# Altium schematic sheet Connectors.SchDoc: Connectors
size A4; ApprovedBy: Diogo Gomes; CheckedBy: Bruno, Candido, Pedro; Author: João Vieira; CompanyName: LART; DrawnBy: João Vieira; Organization: LART; Address1: Morro do Lena; Address2: Alto Do Vieiro; Address3: APT 4163, Building D; Revision: v1.4.2; SheetNumber: 3; SheetTotal: 7; ProjectTitle: Autonomous Control Unit; CheckedBy1: G. Candido; CheckedBy2: F. Chen; CheckedBy3: P. Ferreira; CheckedBy4: B. Vicente; CheckedBy5: _; CheckedBy6: _; CheckedBy7: _; version_tag: v1.4.2; Summary: Generic connections IO hardware; ImagePath: C:\Users\micron\Desktop
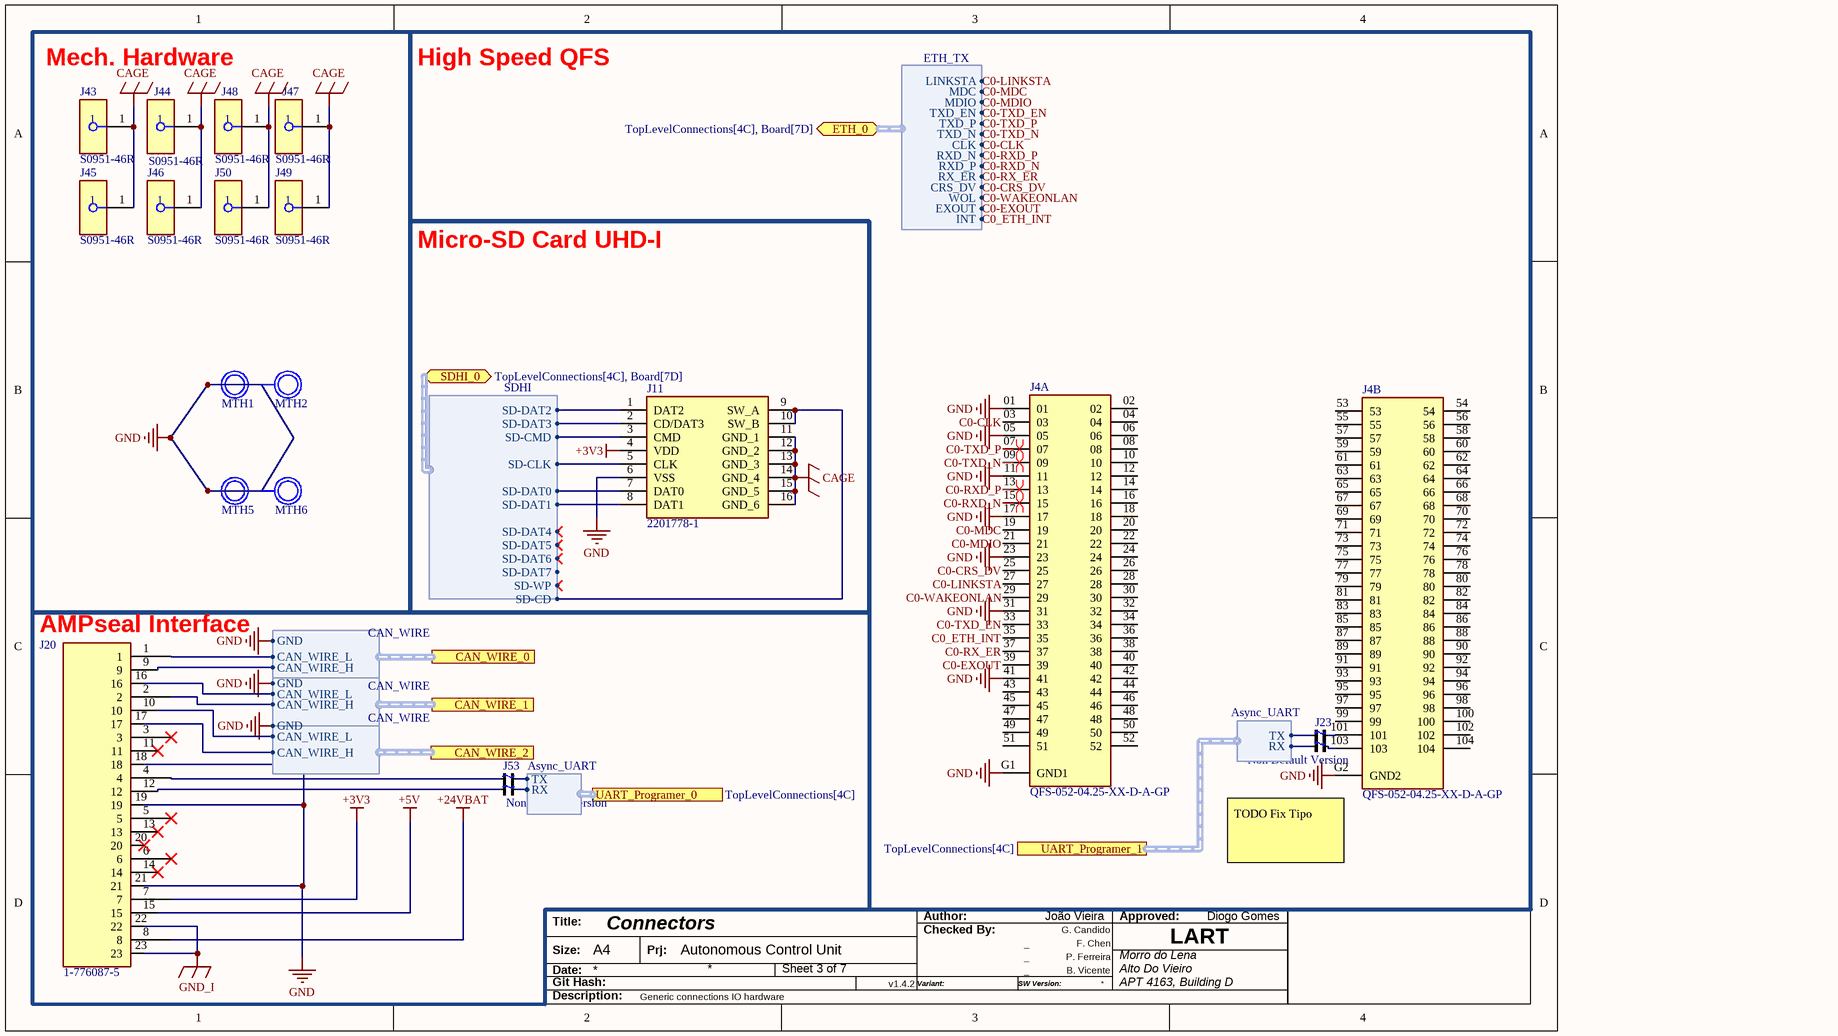
[diagram p0: Connectors.SchDoc]

## Parts
J4  QFS-052-04.25-XX-D-A-GP  [SAMTEC_QFS-052-04.25-XX-D-A-GP]  (parts A,B of 2)
J11  2201778-1  [22017781]
J20  1-776087-5  [TE_1-776087-5]
J23  Non Default Version  [PokaYoke Blank]  (no BOM)
J43  S0951-46R  [FP-S0951-46R-MFG]
J44  S0951-46R  [FP-S0951-46R-MFG]
J45  S0951-46R  [FP-S0951-46R-MFG]
J46  S0951-46R  [FP-S0951-46R-MFG]
J47  S0951-46R  [FP-S0951-46R-MFG]
J48  S0951-46R  [FP-S0951-46R-MFG]
J49  S0951-46R  [FP-S0951-46R-MFG]
J50  S0951-46R  [FP-S0951-46R-MFG]
J53  Non Default Version  [PokaYoke Blank]  (no BOM)
MTH1  Mounting_Hole_3.5mm  [Mounting_Hole_3.5mm]  (value not drawn)
MTH2  Mounting_Hole_3.5mm  [Mounting_Hole_3.5mm]  (value not drawn)
MTH5  Mounting_Hole_3.5mm  [Mounting_Hole_3.5mm]  (value not drawn)
MTH6  Mounting_Hole_3.5mm  [Mounting_Hole_3.5mm]  (value not drawn)

## Blocks framed on the sheet
Mech. Hardware: J43-J50 MTH1 MTH2 MTH5 MTH6
High Speed QFS: J4 J23
Micro-SD Card UHD-I: J11

## Ports
CAN_WIRE_0 (harness CAN_WIRE, see TopLevelConnections[4B], CanFD[3A]), CAN_WIRE_1 (harness CAN_WIRE, see TopLevelConnections[4B], CanFD[3B]), CAN_WIRE_2 (harness CAN_WIRE, see TopLevelConnections[4B], CanFD[3B]), ETH_0 (bidir, harness ETH_TX, see TopLevelConnections[4C], Board[7D]), SDHI_0 (bidir, harness SDHI, see TopLevelConnections[4C], Board[7D]), UART_Programer_0 (harness Async_UART, see TopLevelConnections[4C]), UART_Programer_1 (harness Async_UART, see TopLevelConnections[4C])

## Harnesses
ETH_TX: MDC, MDIO, TXD_EN, TXD_P, TXD_N, CLK, RXD_N, RXD_P, RX_ER, LINKSTA, CRS_DV, WOL, EXOUT, INT
SDHI: SD-CD, SD-CLK, SD-CMD, SD-DAT0, SD-DAT1, SD-DAT2, SD-DAT3, SD-DAT5, SD-DAT6, SD-WP, SD-DAT4, SD-DAT7
CAN_WIRE: GND, CAN_WIRE_H, CAN_WIRE_L
Async_UART: RX, TX

## Nets
+3V3: J11.4(VDD) J20.7
+5V: J20.15
+24VBAT: J20.8
CAGE: J11.11(GND_1) J11.12(GND_2) J11.13(GND_3) J11.14(GND_4) J11.15(GND_5) J11.16(GND_6) J43.1 J44.1 J45.1 J46.1 J47.1 J48.1 J49.1 J50.1
GND: J4.01 J4.05 J4.11 J4.17 J4.23 J4.31 J4.41 J4.G1(GND1) J4.G2(GND2) J11.6(VSS) J20.18 J20.19 J20.21 MTH1.1 MTH2.1 MTH5.1 MTH6.1 ; port CAN_WIRE_1.GND, port CAN_WIRE_0.GND, port CAN_WIRE_2.GND
GND_I: J20.22 J20.23
C0-CLK: J4.03 ; port ETH_0.CLK
C0-CRS_DV: J4.25 ; port ETH_0.CRS_DV
C0-EXOUT: J4.39 ; port ETH_0.EXOUT
C0-LINKSTA: J4.27 ; port ETH_0.LINKSTA
C0-MDC: J4.19 ; port ETH_0.MDC
C0-MDIO: J4.21 ; port ETH_0.MDIO
C0-RX_ER: J4.37 ; port ETH_0.RX_ER
C0-RXD_N: J4.15 ; port ETH_0.RXD_P
C0-RXD_P: J4.13 ; port ETH_0.RXD_N
C0-TXD_EN: J4.33 ; port ETH_0.TXD_EN
C0-TXD_N: J4.09 ; port ETH_0.TXD_N
C0-TXD_P: J4.07 ; port ETH_0.TXD_P
C0-WAKEONLAN: J4.29 ; port ETH_0.WOL
C0_ETH_INT: J4.35 ; port ETH_0.INT
NetJ4_101: J4.101 J23.TX_1
NetJ4_103: J4.103 J23.RX_1
NetJ11_1: J11.1(DAT2) ; port SDHI_0.SD-DAT2
NetJ11_2: J11.2(CD/DAT3) ; port SDHI_0.SD-DAT3
NetJ11_3: J11.3(CMD) ; port SDHI_0.SD-CMD
NetJ11_5: J11.5(CLK) ; port SDHI_0.SD-CLK
NetJ11_7: J11.7(DAT0) ; port SDHI_0.SD-DAT0
NetJ11_8: J11.8(DAT1) ; port SDHI_0.SD-DAT1
NetJ11_9: J11.9(SW_A) J11.10(SW_B) ; port SDHI_0.SD-CD
NetJ20_1: J20.1 ; port CAN_WIRE_0.CAN_WIRE_L
NetJ20_2: J20.2 ; port CAN_WIRE_1.CAN_WIRE_H
NetJ20_4: J20.4 J53.TX_0
NetJ20_9: J20.9 ; port CAN_WIRE_0.CAN_WIRE_H
NetJ20_10: J20.10 ; port CAN_WIRE_2.CAN_WIRE_L
NetJ20_12: J20.12 J53.RX_0
NetJ20_16: J20.16 ; port CAN_WIRE_1.CAN_WIRE_L
NetJ20_17: J20.17 ; port CAN_WIRE_2.CAN_WIRE_H
NetJ23_RX_0: J23.RX_0 ; port UART_Programer_1.RX
NetJ23_TX_0: J23.TX_0 ; port UART_Programer_1.TX
NetJ53_RX_1: J53.RX_1 ; port UART_Programer_0.RX
NetJ53_TX_1: J53.TX_1 ; port UART_Programer_0.TX

Not connected (* = marked no-connect by the designer): J4 02 04 06 08 10 12 14 16 18 20 22 24 26 28 30 32 34 36 38 40 42 43 44 45 46 47 48 49 50 51 52 53 54 55 56 57 58 59 60 61 62 63 64 65 66 67 68 69 70 71 72 73 74 75 76 77 78 79 80 81 82 83 84 85 86 87 88 89 90 91 92 93 94 95 96 97 98 99 100 102 104; J20 3* 5* 6* 11* 13* 14* 20*

## Layout directives
differential pair: C0-RXD_N, C0-RXD_P, C0-TXD_N, C0-TXD_P

## Notes on the sheet
- (near J20) AMPseal Interface
- (near J4) TODO Fix Tipo
- Title:
- Author:
- Checked By:
- Approved:
- Size:
- Date:
- Git Hash:
- A4
- Prj:
- Variant:
- SW Version:
- Description:

## Library data of the parts
J4 = QFS-052-04.25-XX-D-A-GP: CONN RCPT 104POS SMD GOLD; Availability: Unavailable; Package: None; MP: QFS-052-04.25-XX-D-A-GP; Value: *; Price: None
J11 = 2201778-1: Connector; Manufacturer_Name: TE Connectivity; Datasheet Link: https://www.te.com/commerce/DocumentDelivery/DDEController?Action=showdoc&DocId=Customer+Drawing%7F2201778%7FB%7Fpdf%7FJapanese%7FJPN_CD_2201778_B.pdf%7F2201778-1; Height: 1.95mm; Manufacturer_Part_Number: 2201778-1; Mouser Part Number: 571-2201778-1; Mouser Price/Stock: https://www.mouser.co.uk/ProductDetail/TE-Connectivity/2201778-1?qs=%2F6W%2F9%2FHWvcBMWWw9w8oBng%3D%3D; Arrow Part Number: 2201778-1; Arrow Price/Stock: https://www.arrow.com/en/products/2201778-1/te-connectivity?region=nac
J20 = 1-776087-5: CONN HDR 23POS R/A W/GASKET AU; MF: {'manufacturer': 'TE Connectivity'}; Package: None; Value: *; Availability: Unavailable; MP: 1-776087-5; Price: None
J23 J53 = Poka-Yoke 2x2
J43-J50 = CMP-002-00075-1: Assembly Item